# Altium schematic sheet 04_Driver.SchDoc: Driver Cirquit
size A4
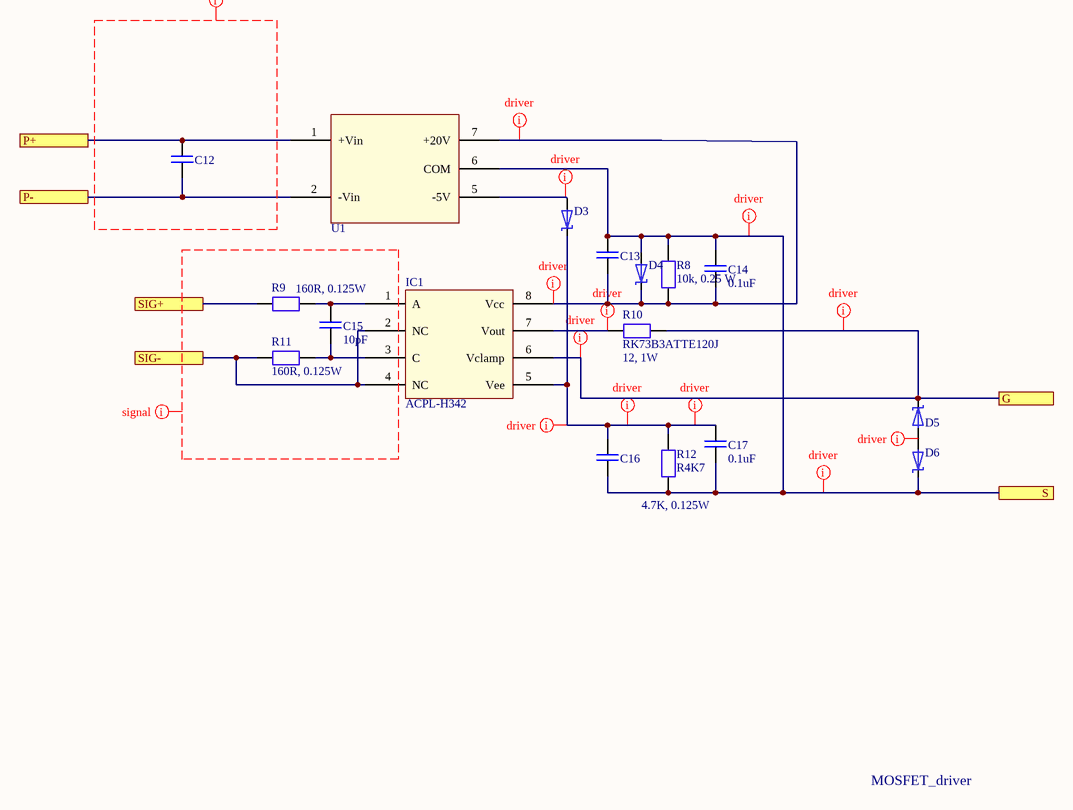
[diagram p0: 04_Driver.SchDoc]

## Parts
C12  Cer_large  [CAPC3227X25N]  (value not drawn)
C13  Cer_large  [CAPC3227X25N]  (value not drawn)
C14  value 0.1uF  [C_0805]  (hidden comment: C0805C104K5RAC)
C15  value 10pF  [C_0805]  (hidden comment: C0805C100J1GAC)
C16  Cer_large  [CAPC3227X25N]  (value not drawn)
C17  value 0.1uF  [C_0805]  (hidden comment: C0805C104K5RAC)
D3  Zener_1.8V  [SOD123]  (value not drawn)
D4  DZ2J220M0L  [SOD323F]  (value not drawn)
D5  MMSZ4678T1G  [CAPM3216X18N]  (value not drawn)
D6  MMSZ4678T1G  [CAPM3216X18N]  (value not drawn)
IC1  ACPL-H342  [SOIC127P970X330-8N]
R8  value 10k, 0.25 W  [SMD_1206]  (hidden comment: RK73H2BTTD1002F)
R9  value 160R, 0.125W  [SMD_0805]  (hidden comment: RK73H2ATTD1600F)
R10  RK73B3ATTE120J  value 12, 1W  [SMD_2512]
R11  value 160R, 0.125W  [SMD_0805]  (hidden comment: RK73H2ATTD1600F)
R12  R4K7  value 4.7K, 0.125W  [smd_0603]
U1  MGJ2D242005SC  [MGJ2]  (value not drawn)

## Ports
G, P+, P-, S, SIG+, SIG-

## Nets
G: D5.1 IC1.6(Vclamp) R10.2 ; port G
P+: C12.1 U1.1(+Vin) ; port P+
P-: C12.2 U1.2(-Vin) ; port P-
S: C13.1 C14.1 C16.2 C17.2 D4.1 D6.1 R8.2 R12.1 U1.6(COM) ; port S
SIG+: R9.1 ; port SIG+
SIG-: IC1.2(NC) IC1.4(NC) R11.1 ; port SIG-
NetC13_2: C13.2 C14.2 D4.2 IC1.8(Vcc) R8.1 U1.7(+20V)
NetC15_1: C15.1 IC1.1(A) R9.2
NetC15_2: C15.2 IC1.3(C) R11.2
NetC16_1: C16.1 C17.1 D3.2 IC1.5(Vee) R12.2
NetD3_1: D3.1 U1.5(-5V)
NetD5_2: D5.2 D6.2
NetIC1_7: IC1.7(Vout) R10.1

## Layout directives
net class Driver: G, NetC13_2, NetC16_1, NetD3_1, NetD5_2, NetIC1_7, S
net class Signal: (no net found under the mark)

## Notes on the sheet
- MOSFET_driver

## Library data of the parts
C12 C13 C16 = Cer_large: Order code: 1759466; Value: 22mkF; Type: 16V; Supplier: Farnel; Price: 0.407; Package: 1210
C14 C17 = C0805C104K5RAC: 0.1u, 50V; Manufacturer: Kemet; Order code: 6576631; Supplier: Elfa; Price: 0,06; Type: C0805C104K5RAC; Package: smd 0805
C15 = C0805C100J1GAC: 10p, 100V; Manufacturer: Kemet; Order code: 6576805; Supplier: Elfa; Price: 0,266; Type: C0805C100J1GAC; Package: smd 0805
D3 = Zener_1.8V: Zener diode; Type: 0.5W; Value: 1.8V; Order code: 1459115; Supplier: Farnell; Price: 0.172; Package: SOD-123
D4 = DZ2J220M0L: Type: Zener diode; Value: 22V, 200mW; Order code: 2285315; Package: SOD323F; Supplier: Farnel; Price: 0.041
D5 D6 = Zener_MMSZ5233BT1G: 6V, 500mW, Zener Diodes; Manufacturer: ON Semiconductor; Order code: 863-MMSZ5233BT1G; Supplier: Mouser; Price: 0,18; Package: SOD-123-2; Type: Zener Diodes; PartNumber: MMSZ5233BT1G; Value: 6V, 500mW
IC1 = ACPL-H342: Manufacturer: Avago; Order code: 1833408; Value: 2,5 A, 12-30V; Package: SSO-8; Price: 2; Publisher: *; Supplier: Farnell; Type: ACPL-H342
R8 = RK73H2BTTD1002F: 10k, 0.25 W; Manufacturer: KOA; Order code: 6019731; Price: 0,111; Supplier: Elfa; datasheet: https://www1.elfa.se/data1/wwwroot/assets/datasheets/06016752.pdf; Type: RK73H2BTTD1002F; Package: smd 1206
R9 R11 = RK73H2ATTD1600F: 160R, 0.125W; Manufacturer: KOA; Order code: 60-173-05; Type: 1%, 150V; Price: 0.097; Package: smd 0805; Supplier: Elfa
R10 = RK73B3ATTE120J: Manufacturer: KOA; Order code: 60-205-98; Type: 200V, 5%; Supplier: Elfa; Price: 0,144; Package: smd 2512
R12 = R4K7: Order code: 9332154; Type: 16V, 1%; Package: smd 0603; Manufacturer: *; Supplier: Farnel; Price: 0.01
U1 = MGJ2D242005SC: Value: 2W; Order code: 2420071; Type: 12V/20V/-5V; Supplier: Farnell; Package: 7dip; Price: 7.49